# Altium project IO BOARD CERES-V3.PrjPcb
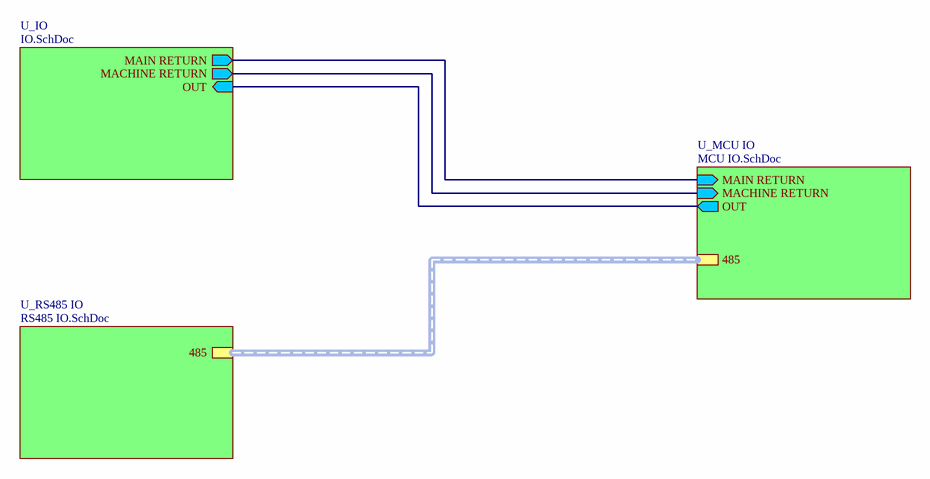
[diagram p0: TOPSHEET.SchDoc]
4 sheets, 56 parts. Net scope: hierarchical (ports join the sheet entries above them; power ports are global).
Board file: IO BOARD CERES V2.PcbDoc
Sheets:
  TOPSHEET.SchDoc
    U_IO = IO.SchDoc
    U_MCU IO = MCU IO.SchDoc
    U_RS485 IO = RS485 IO.SchDoc

## Sheet TOPSHEET.SchDoc: TOPSHEET
size A4; Date: 31 08 2013; Author: Rachid AKKOUCHE; CompanyName: MDI; DrawnBy: Rachid AKKOUCHE; Engineer: Rachid AKKOUCHE; Organization: RASoftware; Address1: 52 J03 rue de la crèche; Address2: 77100 MEAUX; Address3: FRANCE; DocumentNumber: BRA2013090103C1; Revision: C; SheetNumber: 1; SheetTotal: 4; Telephone: +33651604047; Email: rachid.akkouche@wanadoo.fr; Dessinepar: -; Verifiepar: -; Time: 13:22

### Sub-sheets
U_IO = IO.SchDoc: MAIN RETURN (out), OUT (in), MACHINE RETURN (out)
U_MCU IO = MCU IO.SchDoc: MAIN RETURN (in), 485 (harness EIA-485), OUT (out), MACHINE RETURN (in)
U_RS485 IO = RS485 IO.SchDoc: 485 (harness EIA-485)

### Nets
NetC2_1: sheet U_IO/MAIN RETURN, sheet U_MCU IO/MAIN RETURN
NetC3_1: sheet U_IO/MACHINE RETURN, sheet U_MCU IO/MACHINE RETURN
NetQ1_1: sheet U_IO/OUT, sheet U_MCU IO/OUT

### Buses and harness runs
harness sheet U_MCU IO/485 = sheet U_RS485 IO/485

### Notes on the sheet
- Ce document est la propriété de
- Project:
- Il ne peut être divulgué sans l'accord écrit de l'un de ses représentants dûment mandaté
- Title:
- Number:
- Date:
- Time:
- Size:
- A4
- Revision:
- Sheet
- of
- 52 J03 rue de la crèche
- Draw by:
- 77100 Meaux

## Sheet IO.SchDoc: IO
size A4; Date: 31 08 2013; Author: Rachid AKKOUCHE; CompanyName: MDI; DrawnBy: Rachid AKKOUCHE; Engineer: Rachid AKKOUCHE; Organization: RASoftware; Address1: 52 J03, rue de la crèche; Address2: 77100 MEAUX; Address3: FRANCE; DocumentNumber: BRA2013090103C3; Revision: C; SheetNumber: 3; SheetTotal: 4; Telephone: +33651604047; Email: rachid.akkouche@wanadoo.fr; Dessinepar: -; Verifiepar: -; Property: RASoftware; Time: 13:22
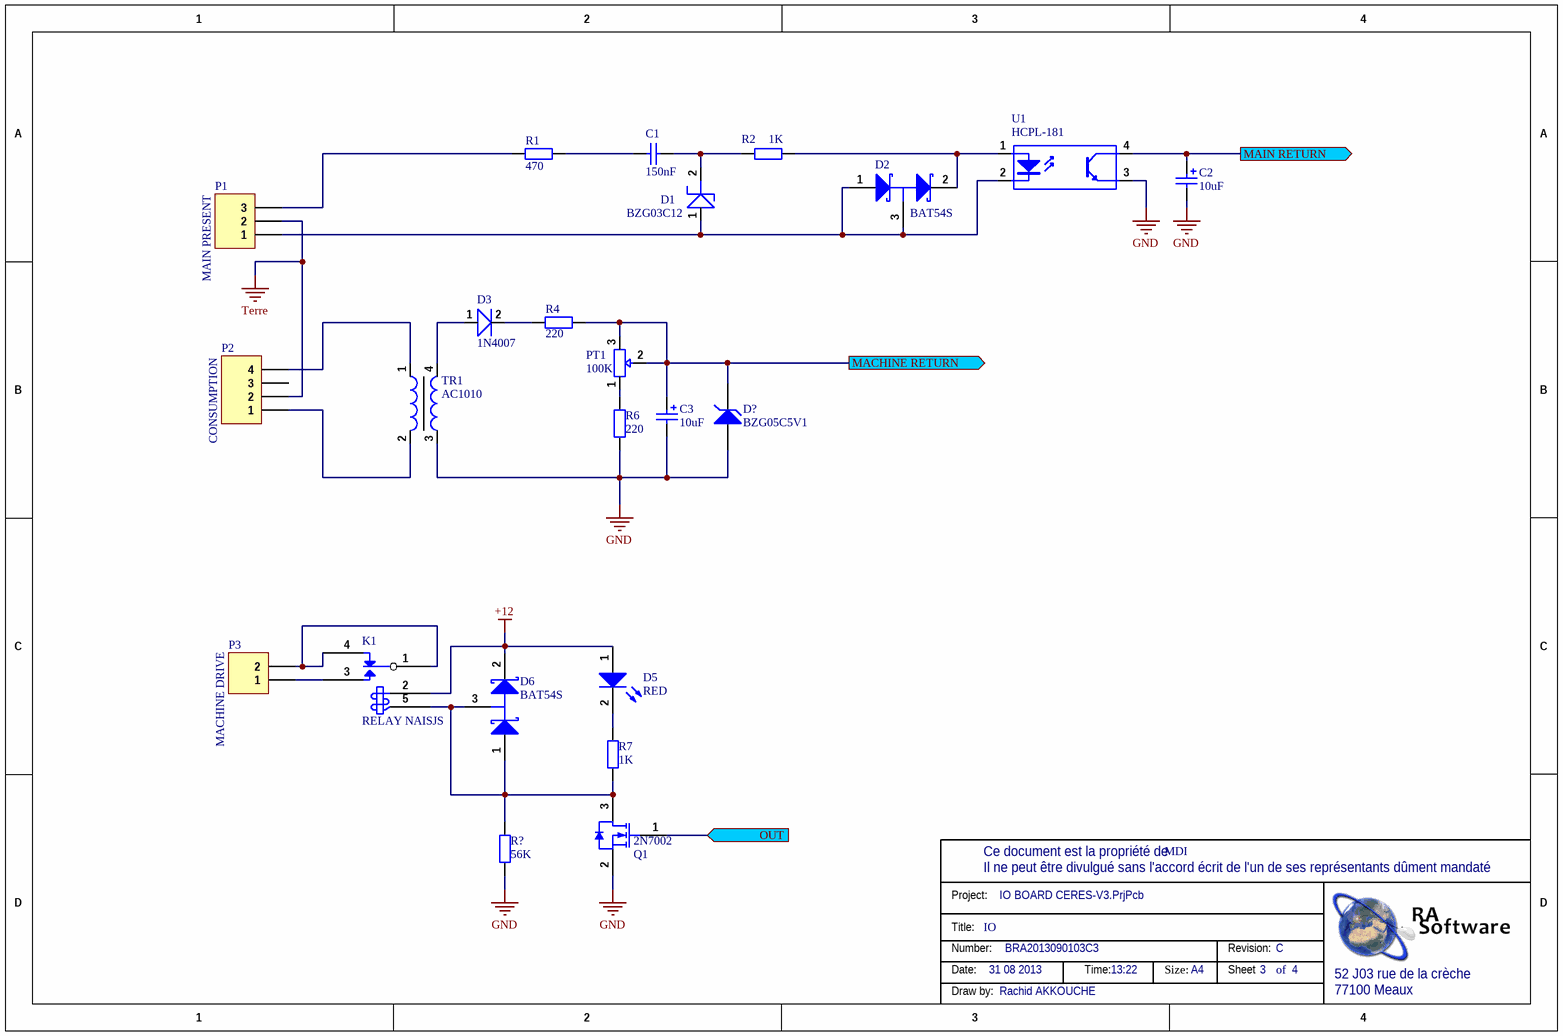
[diagram p1: IO.SchDoc]

### Parts
C1  150nF  [C1210]
C2  10uF  [Kemet_63]
C3  10uF  [Kemet_63]
D1  BZG03C12  [DO214AA]
D2  BAT54S  [SOT23]
D3  1N4007  [DO214AA]
D5  Couleur: RED  [0603-LEDR]  (hidden comment: HSMH-C190)
D6  BAT54S  [SOT23]
D?  BZG05C5V1  [DO214]
K1  RELAY NAISJS  [RELAIG5L]
P1  MAIN PRESENT  [CO3P508]
P2  CONSUMPTION  [CO4P508]
P3  MACHINE DRIVE  [CO2P508]
PT1  100K  [3361P]
Q1  2N7002  [SOT23]
R1  470  [R0805]
R2  1K  [R0805]
R4  220  [R0805]
R6  220  [R0805]
R7  1K  [R0805]
R?  56K  [R0805]
TR1  AC1010  [TR-AC10XX]
U1  HCPL-181  [OPTO-4PIN]

### Ports
MACHINE RETURN (out), MAIN RETURN (out), OUT (in)

### Nets
+12: D5.1(A) D6.2(K) K1.2(COIL1)
GND: C2.2 C3.2 D?.1(A) Q1.2(S) R6.1 R?.1 TR1.3 U1.3(E)
Terre: P1.2 P2.2
NetC1_1: C1.1 R1.1
NetC1_2: C1.2 D1.2 R2.1
NetC2_1: C2.1 U1.4(C) ; port MAIN RETURN
NetC3_1: C3.1 D?.2(K) PT1.2 PT1.3 R4.1 ; port MACHINE RETURN
NetD1_1: D1.1 D2.1(A) D2.3(C) P1.1 U1.2(K)
NetD2_2: D2.2(K) R2.2 U1.1(A)
NetD3_1: D3.1 TR1.4
NetD3_2: D3.2 R4.2
NetD5_2: D5.2(K) R7.2
NetD6_1: D6.1(A) D6.3(C) K1.5(COIL2) Q1.3(D) R7.1 R?.2
NetK1_1: K1.1(COMMON) K1.4(NC) P3.2
NetK1_3: K1.3(NO) P3.1
NetP1_3: P1.3 R1.2
NetP2_1: P2.1 TR1.2
NetP2_4: P2.4 TR1.1
NetPT1_1: PT1.1 R6.2
NetQ1_1: Q1.1(G) ; port OUT

Not connected (* = marked no-connect by the designer): P2 3

### Notes on the sheet
- Ce document est la propriété de
- Project:
- Il ne peut être divulgué sans l'accord écrit de l'un de ses représentants dûment mandaté
- Title:
- Number:
- Date:
- Time:
- Size:
- A4
- Revision:
- Sheet
- of
- 52 J03 rue de la crèche
- Draw by:
- 77100 Meaux

### Library data of the parts
C1 = Cap: Capacitor; Manufacturer: KEMET; Manufacturer Part Number: C1210V154KCRACTU; Gamme de produit: KEMET - ArcShield V Series; Capacité: 0.15; Tolérance de capacité: ± 10%; Diélectrique: X7; Tension: 500; Boîtier de condensateur Céramique: 1210 [3225 Metric]; Température d'utilisation min: -55; Température de fonctionnement max..: 125; Type de packaging: Bande découpée; SVHC: No SVHC (16-Dec-2013); Bornes de condensateur: CMS; Température de fonctionnement: -55°C à +125; Type de boîtier de condensateur: 1210 [3225 Metric]<!--FANDB--><div class="features-and-benefits-container"></div>; Supplier 1: Farnell; Supplier Part Number 1: 2085200; RoHS: YES; Pricing 1: 10=0,34, 50=0,28, 100=0,154, 500=0,125, 2500=0,097 (EUR); MSL: MSL 1 - Illimité; Tolérance de capacité ±: ± 10%; ComponentLink1URL: http://www.farnell.com/datasheets/1698777.pdf; ComponentLink1Description: http://www.farnell.com/datasheets/1698777.pdf
C2 C3 = Cap Pol 100uF: Polarized Capacitor; Manufacturer: EPCOS; Manufacturer Part Number: B41142A4107M; Product Range: EPCOS - B41142 Series; Capacité: 100; Tolérance de capacité: ± 20%; Tension: 16; Type de boîtier de condensateur: Radial Can - SMD; Diamètre: 6.3; Résistance, ESR: 0.16; Hauteur: 7.7; Courant d'ondulation c.a.: 300; Type de packaging: Cut Tape; Durée de vie @ température: 2000 heures @ 105; Température d'utilisation min: -55; Température de fonctionnement max..: 105; SVHC: No SVHC (19-Dec-2012); Impédance: 0.26; Température de fonctionnement: -55°C à +105; Température, ESR: 20; Type de boîtier: CMS; Supplier 1: Farnell; RoHS: YES; Pricing 1: 10=0,123, 50=0,095, 100=0,078, 250=0,07, 1000=0,062 (EUR); Courant d'ondulation c.a. à  100Hz: 300; Fréquence, impédance: 100; Longueur/hauteur: 7.7; Température, courant ondulatoire: 105; Température, impédance: 20; ComponentLink1URL: http://www.epcos.com/inf/20/30/db/alu_x/B41142.pdf; ComponentLink1Description: http://www.epcos.com/inf/20/30/db/alu_x/B41142.pdf; Supplier Part Number 1: 1735328
D1 = DZ: Manufacturer: VISHAY; Manufacturer Part Number: BZG03C12TR3; Supplier 1: Farnell; Supplier Part Number 1: 9398090; RoHS: YES; Pricing 1: 5=0,62, 100=0,37, 1500=0,26, 3000=0,138, 7000=0,135, 30000=0,132, 30000=0,129 (EUR); ComponentLink1URL: http://www.farnell.com/datasheets/69906.pdf; ComponentLink1Description: http://www.farnell.com/datasheets/69906.pdf
D2 D6 = BAT54S: Schottky Barrier Double Diode; Manufacturer: MULTICOMP; Courant, If moy.: 200; Tension, Vrrm: 30; Tension, Vf max..: 400; Temps trr max.: 5; Courant, Ifs max.: 600; Type de boîtier diode: SOT-23; Nombre de broches: 3; SVHC: No SVHC (19-Dec-2012); Configuration diode: Dual Series; Température, Tj max..: 150; Type de terminaison: SMD; Température d'utilisation min: -55; Courant, If, Vf: 10; Courant, Ir, max..: 2; Marquage, CMS: L44; Température de fonctionnement: -55°C à +150; Supplier 1: Farnell; Supplier Part Number 1: 1621835; Manufacturer Part Number: BAT54S; RoHS: YES; Stock 1: 52055; Pricing 1: 10=0,102, 250=0,074, 1000=0,06, 3000=0,053 (EUR); Diode Type: Schottky; Type de boîtier: SOT-23; courant Ifsm: 600; ComponentLink1URL: http://www.farnell.com/datasheets/1317753.pdf; ComponentLink1Description: http://www.farnell.com/datasheets/1317753.pdf; Température de fonctionnement max..: 150
D3 = D: Manufacturer: DC COMPONENTS; Manufacturer Part Number: S1M; Unit: pcs; SuppliedAmount: 3000; MinAmount: 10; Multiples: 1; Diode type: rectifying; Off state voltage max.: 1kV; Forward voltage at If: 1.1V; Load current: 1A; Reverse recovery time: 1.8µs; Capacitance: 12pF; Supplier 1: TME; Supplier Part Number 1: S1M; Category: SMD Universal Diodes; Stock 1: 88611; Pricing 1: 10=0,069, 50=0,048, 250=0,044, 1000=0,039, 5000=0,036 (USD); Weight: 0,213; Price Type: NET; Mounting: SMD; Case: DO214AA; ComponentLink1URL: http://www.tme.eu/en/details/s1m/smd-universal-diodes/dc-components/; ComponentLink1Description: http://www.tme.eu/en/details/s1m/smd-universal-diodes/dc-components/
D5 = HSMH-C190: Surface Mount Chip LED, Red; Manufacturer: AVAGO TECHNOLOGIES; Manufacturer Part Number: HSMH-C190.; Taille de lampe: 0.8mm x 1; Couleur de LED: Rouge; Intensité lumineuse: 17; Angle, vision: 170°; Courant, direct, If: 20; Tension, direct à  If: 1.8; Montage LED: CMS; Forme de lentille: Rectangulaire; Longueur d'onde typ.: 626; SVHC: No SVHC (19-Dec-2012); Dissipation de puissance: 65; Intensité lumineuse min. à  If: 2.8; Intensité lumineuse typique: 10; Largeur (externe): 0.8; Longueur d'onde dominante: 639; Longueur d'onde, crête: 630; Longueur/hauteur: 1.6; Matière: AlGaAs; Nombre de broches: 2; Orientation de montage opto: Dessus; Orientation sortie de lumière: Top Emitting; Température de fonctionnement: -30°C à +85; Température de fonctionnement max..: 85; Température, stockage min.: -40; Température d'utilisation min: -30; Tension, Vf max..: 2.6; Tension, Vf min.: 2.1; Type de LED: Standard; Supplier 1: Farnell; Supplier Part Number 1: 8554641; RoHS: YES; Pricing 1: 5=0,06, 25=0,059, 100=0,057, 250=0,052, 500=0,047 (EUR); MSL: MSL 2A - 4 semaines; Couleur, LED: Rouge; Profondeur: 0.8; Température, stockage max..: 85; Tension, Vf typ.: 1.8; ComponentLink1URL: http://www.farnell.com/datasheets/313031.pdf; ComponentLink1Description: http://www.farnell.com/datasheets/313031.pdf; ComponentLink2URL: http://www.farnell.com/datasheets/55927.pdf; ComponentLink2Description: http://www.farnell.com/datasheets/55927.pdf
D? = BZG05C5V1: Silicon Zener Diode (3W); Manufacturer: VISHAY; Unit: pcs; SuppliedAmount: 100; MinAmount: 5; Multiples: 1; Zener voltage: 5.1V; Zener current: 45mA; Zener resistance: 10Ω; Supplier 1: TME; Supplier Part Number 1: BZG05C5V1; Manufacturer Part Number: BZG05C5V1; Category: SMD Zener Diodes; Stock 1: 1665; Weight: 0,098; Price Type: NET; Diode type: Zener; Power: 3W; Mounting: SMD; Case: DO214AC; ComponentLink1URL: http://www.tme.eu/en/details/bzg05c5v1/smd-zener-diodes/vishay/; ComponentLink1Description: http://www.tme.eu/en/details/bzg05c5v1/smd-zener-diodes/vishay/
K1 = RELAY NAISJS: Manufacturer: OMRON ELECTRONIC COMPONENTS; Manufacturer Part Number: G5LA1A412DC; Type de relais: Puissance; Tension, bobine c.c. nom.: 12; Courant de contact max..: 10; Tension AC nominale du contact: 250; Tension DC nominale du contact: 24; Résistance, bobine: 400; Configuration des contacts: SPST-NO; Type de bobine: CC; Courant de bobine: 30; Puissance de fonctionnement nominale: 360; Montage relais: Traversant; Largeur (externe): 15.8; Profondeur: 19.8; SVHC: No SVHC (20-Jun-2013); Supplier 1: Farnell; Supplier Part Number 1: 2213790; RoHS: YES; Pricing 1: 1=0,84, 10=0,74, 50=0,66, 100=0,59, 250=0,54 (EUR); Hauteur, dimension externe: 15.8; ComponentLink1URL: http://www.farnell.com/datasheets/1648381.pdf; ComponentLink1Description: http://www.farnell.com/datasheets/1648381.pdf
P1 = Header 3: Header, 3-Pin; Manufacturer: TE CONNECTIVITY / BUCHANAN; Manufacturer Part Number: 796636-3; Supplier 1: Farnell; Supplier Part Number 1: 2059780; RoHS: YES; Pricing 1: 10=0,68, 100=0,51, 500=0,43, 1000=0,36, 2000=0,35, 5000=0,33 (EUR); ComponentLink1URL: http://www.farnell.com/cad/1652960.pdf; ComponentLink1Description: http://www.farnell.com/cad/1652960.pdf; ComponentLink2URL: http://www.farnell.com/datasheets/1650926.pdf; ComponentLink2Description: http://www.farnell.com/datasheets/1650926.pdf
P2 = Header 4: Header, 4-Pin; Manufacturer: TE CONNECTIVITY / BUCHANAN; Manufacturer Part Number: 796636-4; Supplier 1: Farnell; Supplier Part Number 1: 2059781; RoHS: YES; Stock 1: 207; ComponentLink1URL: http://www.farnell.com/cad/1652960.pdf; ComponentLink1Description: http://www.farnell.com/cad/1652960.pdf; ComponentLink2URL: http://www.farnell.com/datasheets/1650926.pdf; ComponentLink2Description: http://www.farnell.com/datasheets/1650926.pdf
P3 = Header 2: Header, 2-Pin; Manufacturer: TE CONNECTIVITY / BUCHANAN; Manufacturer Part Number: 796636-2; Terminaison du contact: Traversant vertical; Genre: Embase; Nombre de contacts: 2; Nombre de rangées: 1; Pas: 5.08; Plaquage du contact: Etain; Matériau du contact: Bronze phosphoreux<!--FANDB--><div class="features-and-benefits-container"></div>; Supplier 1: Farnell; Supplier Part Number 1: 2059815; RoHS: YES; Pricing 1: 10=0,5, 100=0,39, 500=0,34, 1000=0,27, 2000=0,211, 5000=0,207, 5000=0,203, 30000=0,199 (EUR); Gamme de produit: -; ComponentLink1URL: http://www.farnell.com/cad/1652960.pdf; ComponentLink1Description: http://www.farnell.com/cad/1652960.pdf; ComponentLink2URL: http://www.farnell.com/datasheets/1509424.pdf; ComponentLink2Description: http://www.farnell.com/datasheets/1509424.pdf
PT1 = RV: Manufacturer: BOURNS; Manufacturer Part Number: 3361P-1-104GLF; Résistance, piste: 100; Nombre de tours: 1; Tolérance de résistance: ± 10%; Coefficient de température: ± 100; Puissance: 500; Montage du potentiomètre: CMS; SVHC: No SVHC (16-Dec-2013); Force diélectrique, Vca: 900; Largeur (externe): 6.71; Longueur/hauteur: 5.21; Profondeur: 7.04; Série: 3361; Température de fonctionnement: -55°C à +125; Température de fonctionnement max..: 125; Température d'utilisation min: -55; Tension: 300; Type d'ajustement: Fente tournevis; Type de packaging: Bande découpée; Type de résistance: Cermet<!--FANDB--><div class="features-and-benefits-container"></div>; Supplier 1: Farnell; Supplier Part Number 1: 1696064; RoHS: YES; Pricing 1: 5=1,35, 50=1,11, 100=0,99, 250=0,93, 750=0,87 (EUR); ComponentLink1URL: http://www.farnell.com/datasheets/1563530.igs; ComponentLink1Description: http://www.farnell.com/datasheets/1563530.igs; ComponentLink2URL: http://www.farnell.com/datasheets/1815105.pdf; ComponentLink2Description: http://www.farnell.com/datasheets/1815105.pdf; ComponentLink3URL: http://www.farnell.com/cad/1563578.stp; ComponentLink3Description: http://www.farnell.com/cad/1563578.stp
Q1 = 2N7002: N-channel Enhancement Mode Field-effect Transistor; Manufacturer: FAIRCHILD SEMICONDUCTOR; Supplier 1: Farnell; Supplier Part Number 1: 9845313; Manufacturer Part Number: 2N7002; RoHS: YES; Pricing 1: 5=0,138, 25=0,13, 100=0,059, 1000=0,049, 3000=0,026, 6000=0,0234 (EUR); ComponentLink1URL: http://www.farnell.com/datasheets/660093.pdf; ComponentLink1Description: http://www.farnell.com/datasheets/660093.pdf; ComponentLink2URL: http://www.farnell.com/datasheets/410597.pdf; ComponentLink2Description: http://www.farnell.com/datasheets/410597.pdf
R1 = Resistor 0805 470: Resistor; Manufacturer: MULTICOMP; Manufacturer Part Number: MC0.1W08051%470RFR; Supplier 1: Farnell; Supplier Part Number 1: 2129087; RoHS: YES; Pricing 1: 5000=0,001 (EUR); ComponentLink1URL: http://www.farnell.com/datasheets/1636796.pdf; ComponentLink1Description: http://www.farnell.com/datasheets/1636796.pdf
R2 = Res2: Resistor; Manufacturer: MULTICOMP; Manufacturer Part Number: MC0.1W08051%1KFR; Product Range: MULTICOMP - MC Series; Résistance: 1; Puissance: 100; Tolérance de résistance: ± 1%; Type de boîtier de résistance: 0805; Type de résistance: Couche épaisse; Coefficient de température: ± 100; Tension: 150; Type de packaging: Full Reel; Resistor Mounting: CMS; Supplier 1: Farnell; Supplier Part Number 1: 2129113; RoHS: YES; Stock 1: 599995; Pricing 1: 5000=0,001 (EUR); MSL: MSL 1 - Illimité; ComponentLink1URL: http://www.farnell.com/datasheets/1636796.pdf; ComponentLink1Description: http://www.farnell.com/datasheets/1636796.pdf
R4 R6 = Resistor 0805 220: Resistor; Manufacturer: MULTICOMP; Manufacturer Part Number: MC01W08051220R; Gamme de produit: MULTICOMP - MC Series; Puissance: 100; Tolérance de résistance: ± 1%; Type de boîtier de résistance: 0805; Type de résistance: Couche épaisse; Coefficient de température: ± 100; Tension: 150; Type de packaging: Bande et Bobine; SVHC: No SVHC (20-Jun-2013); Montage de résistance: CMS; Quantité par bobine: 5000; Supplier 1: Farnell; RoHS: YES; Stock 1: 199995; Pricing 1: 5000=0,001, 25000=0,0009, 50000=0,0008 (EUR); Résistance: 220; MSL: -; ComponentLink1URL: http://www.farnell.com/datasheets/1729047.pdf; ComponentLink1Description: http://www.farnell.com/datasheets/1729047.pdf; Supplier Part Number 1: 2129060
R7 = Resistor 0805 1K: Resistor; Manufacturer: MULTICOMP; Manufacturer Part Number: MC0.1W08051%1KFR; Product Range: MULTICOMP - MC Series; Résistance: 1; Puissance: 100; Tolérance de résistance: ± 1%; Type de boîtier de résistance: 0805; Type de résistance: Couche épaisse; Coefficient de température: ± 100; Tension: 150; Type de packaging: Full Reel; Resistor Mounting: CMS; Supplier 1: Farnell; RoHS: YES; Pricing 1: 5000=0,001 (EUR); MSL: MSL 1 - Illimité; ComponentLink1URL: http://www.farnell.com/datasheets/1716700.pdf; ComponentLink1Description: http://www.farnell.com/datasheets/1716700.pdf; Supplier Part Number 1: 2129113
R? = Resistor 0805 56K: Resistor; Manufacturer: MULTICOMP; Manufacturer Part Number: MC0.1W08051%56KFR; Product Range: MULTICOMP - MC Series; Résistance: 56; Puissance: 100; Tolérance de résistance: ± 1%; Type de boîtier de résistance: 0805; Type de résistance: Couche épaisse; Coefficient de température: ± 100; Tension: 150; Type de packaging: Full Reel; Resistor Mounting: CMS; Resistor Terminals: (Non Disponible); Supplier 1: Farnell; RoHS: YES; Pricing 1: 5000=0,001 (EUR); MSL: (Non Applicable); ComponentLink1URL: http://www.farnell.com/datasheets/1716700.pdf; ComponentLink1Description: http://www.farnell.com/datasheets/1716700.pdf; Supplier Part Number 1: 2129258
TR1 = AC1010: Manufacturer: ACME ELECTRIC; Manufacturer Part Number: AC-1010; Input Current: 10; Turns Ratio: 1; Frequency Min: 50; Frequency Max: 60; Secondary Burden Resistance: 41.8; Transformer Mounting: Through Hole; External Depth: 11.12; Supplier 1: Farnell; Supplier Part Number 1: 1707836; RoHS: YES; Pricing 1: 1=12,43, 10=10,33, 25=8,31, 50=7,37, 100=6,71 (EUR); DC Resistance Max: 41.8; ComponentLink1URL: http://www.amveco.com/pdf/AC1010.pdf; ComponentLink1Description: http://www.amveco.com/pdf/AC1010.pdf
U1 = Optoisolator1: 4-Pin Phototransistor Optocoupler; Manufacturer: AVAGO TECHNOLOGIES; Manufacturer Part Number: HCPL-181-00AE; Supplier 1: Farnell; Supplier Part Number 1: 1244526RL; RoHS: YES; Pricing 1: 150=0,27, 250=0,217, 500=0,191, 2000=0,143, 2000=0,14, 20000=0,137 (EUR); ComponentLink1URL: http://www.farnell.com/datasheets/317140.pdf; ComponentLink1Description: http://www.farnell.com/datasheets/317140.pdf

## Sheet MCU IO.SchDoc: MCU
size A4; Date: 30 08 2013; Author: Rachid AKKOUCHE; CompanyName: MDI; DrawnBy: Rachid AKKOUCHE; Engineer: Rachid AKKOUCHE; Organization: RASoftware; Address1: 52 J03, rue de la crèche; Address3: 77100 MEAUX; Address4: FRANCE; DocumentNumber: BRA2013090103C2; Revision: C; SheetNumber: 2; SheetTotal: 4; Telephone: +33651604047; Email: rachid.akkouche@wanadoo.fr; Dessinepar: -; Verifiepar: -; Property: RASoftware; Time: 13:00; ProjectName: IO BOARD CERES-V3; Application_BuildNumber: 01
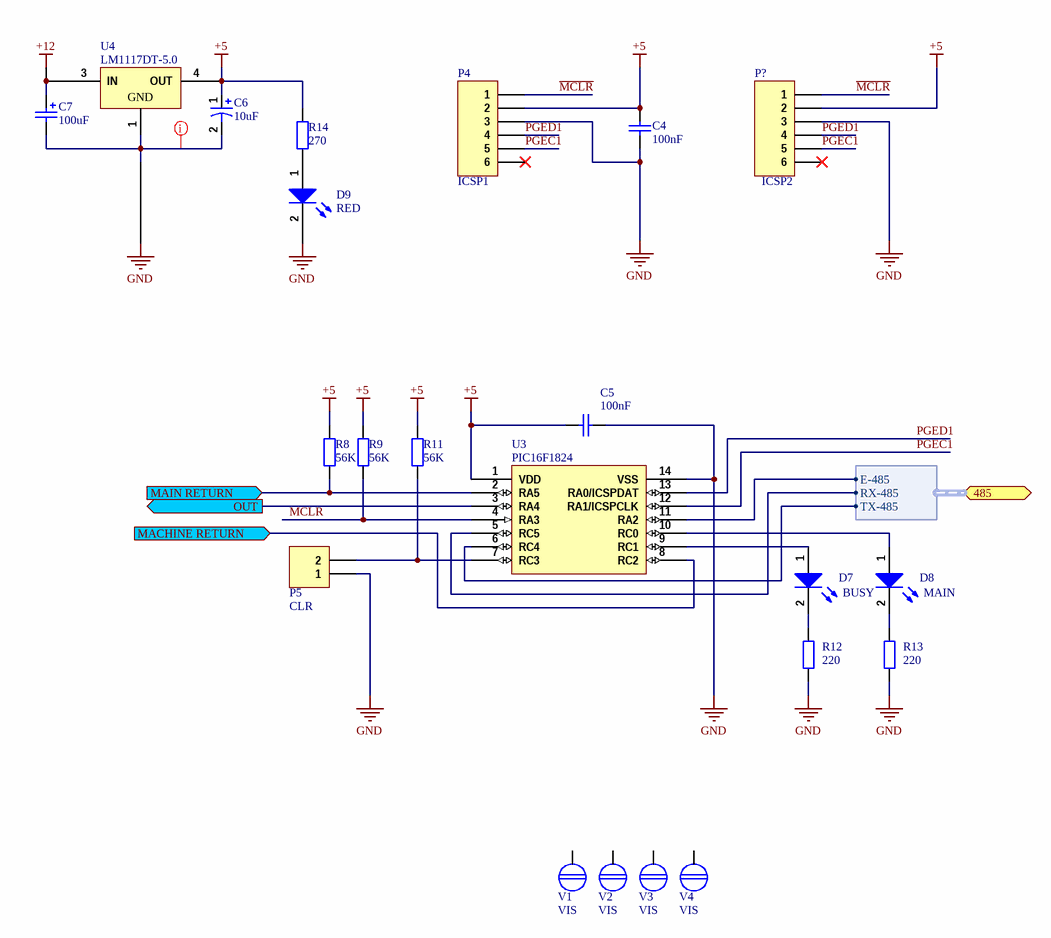
[diagram p2: MCU IO.SchDoc]

### Parts
C4  100nF  [C0805]
C5  100nF  [C0805]
C6  10uF  [KEMET_4]
C7  100uF  [Kemet_63]
D7  Indicator: BUSY  [0603-LEDR]  (hidden comment: HSMH-C190)
D8  Indicator: MAIN  [0603-LEDR]  (hidden comment: HSMH-C190)
D9  Couleur: RED  [0603-LEDR]  (hidden comment: HSMH-C190)
P4  ICSP1  [TC2030]
P5  CLR  [M20_1X2]
P?  ICSP2  [6SIP100]
R8  56K  [R0805]
R9  56K  [R0805]
R11  56K  [R0805]
R12  220  [R0805]
R13  220  [R0805]
R14  270  [R0805]
U3  PIC16F1824  [so-14]
U4  LM1117DT-5.0  [SOT223]
V1  VIS  [VIS42]
V2  VIS  [VIS42]
V3  VIS  [VIS42]
V4  VIS  [VIS42]

### Ports
485 (harness EIA-485), MACHINE RETURN (in), MAIN RETURN (in), OUT (out)

### Harnesses
EIA-485: TX-485, RX-485, E-485

### Nets
+5: C4.2 C5.2 C6.1 P4.2 P?.2 R8.2 R9.2 R11.2 R14.2 U3.1(VDD) U4.4(OUT)
+12: C7.1 U4.3(IN)
GND: C4.1 C5.1 C6.2 C7.2 D9.2(K) P4.3 P5.1 P?.3 R12.1 R13.1 U3.14(VSS) U4.1(GND)
~{MCLR}: P4.1 P?.1 R9.1 U3.4(RA3)
PGEC1: P4.5 P?.5 U3.12(RA1/ICSPCLK)
PGED1: P4.4 P?.4 U3.13(RA0/ICSPDAT)
NetC2_1: R8.1 U3.2(RA5) ; port MAIN RETURN
NetC3_1: U3.8(RC2) ; port MACHINE RETURN
NetD7_1: D7.1(A) U3.9(RC1)
NetD7_2: D7.2(K) R12.2
NetD8_1: D8.1(A) U3.10(RC0)
NetD8_2: D8.2(K) R13.2
NetD9_1: D9.1(A) R14.1
NetP5_2: P5.2 R11.1 U3.7(RC3)
NetQ1_1: U3.3(RA4) ; port OUT
NetR18_2: U3.11(RA2) ; port 485.E-485
NetU3_5: U3.5(RC5) ; port 485.RX-485
NetU3_6: U3.6(RC4) ; port 485.TX-485

Not connected (* = marked no-connect by the designer): P4 6*; P? 6*; V1 1; V2 1; V3 1; V4 1

### Layout directives
rule Width Constraint [Pref Width = 0.55mm    Min Width = 0.254mm    Max Width = 2mm]: GND

### Notes on the sheet
- Ce document est la propriété de
- Project:
- Il ne peut être divulgué sans l'accord écrit de l'un de ses représentants dûment mandaté
- Title:
- Number:
- Date:
- Time:
- Size:
- A4
- Revision:
- Sheet
- of
- 52 J03 rue de la crèche
- Draw by:
- 77100 Meaux

### Library data of the parts
C4 C5 = Cap 0805 100nF: Capacitor; Manufacturer: MULTICOMP; Manufacturer Part Number: MCCA000296; Supplier 1: Farnell; Supplier Part Number 1: 1759167; Pricing 1: 100=0,01, 500=0,008, 1000=0,006, 4000=0,005 (EUR); ComponentLink1URL: http://www.farnell.com/datasheets/1520827.pdf; ComponentLink1Description: http://www.farnell.com/datasheets/1520827.pdf
C6 = Cap Pol1: Polarized Capacitor; Manufacturer: KEMET; Manufacturer Part Number: EXV106M025A9BAA; Supplier 1: Farnell; Supplier Part Number 1: 2069174; RoHS: YES; Pricing 1: 10=0,111, 100=0,085, 500=0,074, 1000=0,07, 5000=0,066 (EUR); ComponentLink1URL: http://www.farnell.com/datasheets/1500293.pdf; ComponentLink1Description: http://www.farnell.com/datasheets/1500293.pdf
C7 = Cap Pol 100uF: as C2 on sheet IO; Supplier 1: Farnell; RoHS: YES; Pricing 1: 10=0,123, 50=0,095, 100=0,078, 250=0,07, 1000=0,062 (EUR); Courant d'ondulation c.a. à  100Hz: 300; Fréquence, impédance: 100; Longueur/hauteur: 7.7; Température, courant ondulatoire: 105; Température, impédance: 20; ComponentLink1URL: http://www.epcos.com/inf/20/30/db/alu_x/B41142.pdf; ComponentLink1Description: http://www.epcos.com/inf/20/30/db/alu_x/B41142.pdf; Supplier Part Number 1: 1735328
D7-D9 = HSMH-C190: as D5 on sheet IO; Supplier 1: Farnell; Supplier Part Number 1: 8554641; RoHS: YES; Pricing 1: 5=0,06, 25=0,059, 100=0,057, 250=0,052, 500=0,047 (EUR); MSL: MSL 2A - 4 semaines; Couleur, LED: Rouge; Profondeur: 0.8; Température, stockage max..: 85; Tension, Vf typ.: 1.8; ComponentLink1URL: http://www.farnell.com/datasheets/313031.pdf; ComponentLink1Description: http://www.farnell.com/datasheets/313031.pdf; ComponentLink2URL: http://www.farnell.com/datasheets/55927.pdf; ComponentLink2Description: http://www.farnell.com/datasheets/55927.pdf
  D7 D8: Couleur: RED
  D9: Stock 1: 13902
P4 = Header 6: Header, 6-Pin; Manufacturer: HARWIN; Manufacturer Part Number: M20-8770642; Type de connecteur: Contact fil-à-carte; Série: M20; Terminaison du contact: Montage en surface vertical; Genre: Embase; Nombre de contacts: 6; Nombre de rangées: 1; Pas: 2.54; Plaquage du contact: Or; Matériau du contact: Laiton; SVHC: No SVHC (19-Dec-2012); Supplier 1: Farnell; Supplier Part Number 1: 1517384; RoHS: YES; Stock 1: 3471; Pricing 1: 10=0,69, 20=0,66, 50=0,62, 100=0,6, 250=0,56, 500=0,49 (EUR); Pas, rang: 2.54; ComponentLink1URL: http://www.farnell.com/datasheets/1089524.pdf; ComponentLink1Description: http://www.farnell.com/datasheets/1089524.pdf; ComponentLink2URL: http://www.farnell.com/datasheets/5481.pdf; ComponentLink2Description: http://www.farnell.com/datasheets/5481.pdf
P5 = Header 2: Header, 2-Pin; Manufacturer: HARWIN; Manufacturer Part Number: M20-8770242; LatestRevisionDate: 17-Jul-2002; LatestRevisionNote: Re-released for DXP Platform.; Publisher: Altium Limited; Supplier 1: Farnell; Supplier Part Number 1: 1895211; RoHS: YES; Pricing 1: 10=0,137, 20=0,136, 50=0,135, 100=0,133, 250=0,128, 500=0,12 (EUR); ComponentLink1URL: http://www.farnell.com/cad/1330190.pdf; ComponentLink1Description: http://www.farnell.com/cad/1330190.pdf
P? = Header 6: Header, 6-Pin; Manufacturer: TE CONNECTIVITY / AMP; Manufacturer Part Number: 4-103321-8.; Série: AMPMODU; Pas: 2.54; Nombre de rangées: 1; Nombre de contacts: 40; Genre: Embase; Terminaison du contact: A souder; Plaquage du contact: Etain; Matériau du contact: Bronze phosphoreux; Courant: 3; Matériau isolant: Thermoplastique; Organismes d'agrément: CSA, UL; Résistance d'isolement: 500; Température de fonctionnement max..: 105; Température d'utilisation min: -65; Type de boitier: Plastique noir UL94V-0; Supplier 1: Farnell; Supplier Part Number 1: 1098454; RoHS: YES; Stock 1: 2602; Pricing 1: 1=2,12, 50=1,79, 100=1,34, 500=1,14, 1000=1,05 (EUR); Méthode de terminaison: A souder; ComponentLink1URL: http://www.tycoelectronics.com/commerce/DocumentDelivery/DDEController?Action=srchrtrv&DocNm=4-103321-8&DocType=Customer+View+Model&DocLang=English; ComponentLink1Description: http://www.tycoelectronics.com/commerce/DocumentDelivery/DDEController?Action=srchrtrv&DocNm=4-103321-8&DocType=Customer+View+Model&DocLang=English; ComponentLink2URL: http://www.farnell.com/datasheets/38278.pdf; ComponentLink2Description: http://www.farnell.com/datasheets/38278.pdf
R8 R9 R11 = Resistor 0805 56K: as R? on sheet IO; Supplier 1: Farnell; RoHS: YES; Pricing 1: 5000=0,001 (EUR); MSL: (Non Applicable); ComponentLink1URL: http://www.farnell.com/datasheets/1716700.pdf; ComponentLink1Description: http://www.farnell.com/datasheets/1716700.pdf; Supplier Part Number 1: 2129258
R12 R13 = Resistor 0805 220: as R4 on sheet IO; Supplier 1: Farnell; RoHS: YES; Stock 1: 199995; Pricing 1: 5000=0,001, 25000=0,0009, 50000=0,0008 (EUR); Résistance: 220; MSL: -; ComponentLink1URL: http://www.farnell.com/datasheets/1729047.pdf; ComponentLink1Description: http://www.farnell.com/datasheets/1729047.pdf; Supplier Part Number 1: 2129060
R14 = Resistor 0805 1K: as R7 on sheet IO; Supplier 1: Farnell; RoHS: YES; Pricing 1: 5000=0,001 (EUR); MSL: MSL 1 - Illimité; ComponentLink1URL: http://www.farnell.com/datasheets/1716700.pdf; ComponentLink1Description: http://www.farnell.com/datasheets/1716700.pdf; Supplier Part Number 1: 2129113
U3 = PIC16(L)F1824: 14 Pin Flash Microcontrollers with XLP Technology; Manufacturer: MICROCHIP; Manufacturer Part Number: PIC16F1824-I/SL; Supplier 1: Farnell; RoHS: YES; Stock 1: 516; ComponentLink1URL: http://www.farnell.com/datasheets/1669488.pdf; ComponentLink1Description: http://www.farnell.com/datasheets/1669488.pdf; ComponentLink2URL: http://www.farnell.com/cad/1689044.zip; ComponentLink2Description: http://www.farnell.com/cad/1689044.zip; Supplier Part Number 1: 1814945
U4 = LM1117DT-5.0: 800mA Low-Dropout Linear Regulator, 3-pin TO-252; Manufacturer: TEXAS INSTRUMENTS; Manufacturer Part Number: LM1117MP-5.0; Supplier 1: Farnell; Supplier Part Number 1: 9778209; RoHS: YES; Pricing 1: 1=0,9, 10=0,86, 100=0,73 (EUR); ComponentLink1URL: http://www.farnell.com/datasheets/1685500.pdf; ComponentLink1Description: http://www.farnell.com/datasheets/1685500.pdf; ComponentLink2URL: http://www.farnell.com/cad/1562101.zip; ComponentLink2Description: http://www.farnell.com/cad/1562101.zip

## Sheet RS485 IO.SchDoc: RS-485
size A4; Date: 31 08 2013; Author: Rachid AKKOUCHE; CompanyName: MDI; DrawnBy: Rachid AKKOUCHE; Engineer: Rachid AKKOUCHE; Organization: RASoftware; Address1: 52 J03, rue de la crèche; Address2: 77100 MEAUX; Address3: FRANCE; DocumentNumber: BRA2013090103C4; Revision: C; SheetNumber: 4; SheetTotal: 4; Telephone: +33651604047; Email: rachid.akkouche@wanadoo.fr; Dessinepar: -; Verifiepar: -; Property: RASoftware; Time: 13:22
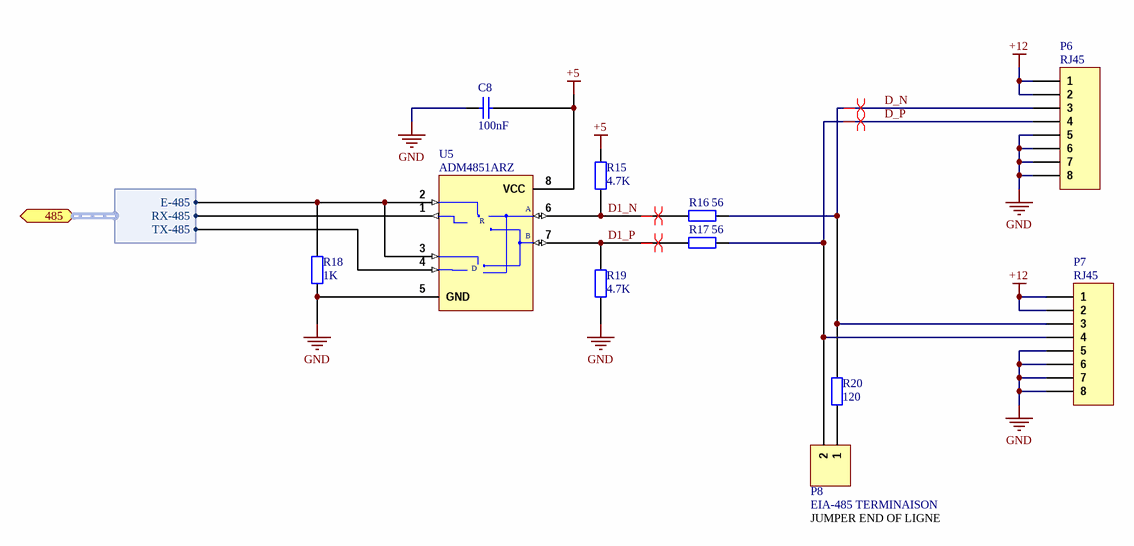
[diagram p3: RS485 IO.SchDoc]

### Parts
C8  100nF  [C0805]
P6  RJ45  [Amphenol-RJ45_8]
P7  RJ45  [Amphenol-RJ45_8]
P8  EIA-485 TERMINAISON  [M20_1X2]
R15  4.7K  [R0805]
R16  56  [R0805]
R17  56  [R0805]
R18  1K  [R0805]
R19  4.7K  [R0805]
R20  120  [R0805]
U5  ADM4851ARZ  [SOIC8]

### Ports
485 (harness EIA-485)

### Harnesses
EIA-485: TX-485, RX-485, E-485

### Nets
+5: C8.1 R15.2 U5.8(VCC)
+12: P6.1 P6.2 P7.1 P7.2
GND: C8.2 P6.5 P6.6 P6.7 P6.8 P7.5 P7.6 P7.7 P7.8 R18.1 R19.1 U5.5(GND)
D1_N: R15.1 R16.1 U5.6(A)
D1_P: R17.1 R19.2 U5.7(B)
D_N: P6.3 P7.3 R16.2 R20.2
D_P: P6.4 P7.4 P8.2 R17.2
NetP8_1: P8.1 R20.1
NetR18_2: R18.2 U5.2(~{RE}) U5.3(DE) ; port 485.E-485
NetU3_5: U5.1(RO) ; port 485.RX-485
NetU3_6: U5.4(DI) ; port 485.TX-485

### Layout directives
differential pair: D1_N, D1_P, D_N, D_P

### Notes on the sheet
- JUMPER END OF LIGNE
- Ce document est la propriété de
- Project:
- Il ne peut être divulgué sans l'accord écrit de l'un de ses représentants dûment mandaté
- Title:
- Number:
- Date:
- Time:
- Size:
- A4
- Revision:
- Sheet
- of
- 52 J03 rue de la crèche
- Draw by:
- 77100 Meaux
- (in symbol MAX485ESA) R; D

### Library data of the parts
C8 = Cap 0805 100nF: as C4 on sheet MCU IO; Supplier 1: Farnell; Supplier Part Number 1: 1759167; Pricing 1: 100=0,01, 500=0,008, 1000=0,006, 4000=0,005 (EUR); ComponentLink1URL: http://www.farnell.com/datasheets/1520827.pdf; ComponentLink1Description: http://www.farnell.com/datasheets/1520827.pdf
P6 P7 = Header 8: Header, 8-Pin; Manufacturer: MOLEX; Manufacturer Part Number: 85502-5008; Supplier 1: Farnell; Supplier Part Number 1: 1331561; RoHS: YES; Pricing 1: 1=1,34, 10=0,873, 50=0,797, 100=0,662, 200=0,597, 500=0,541, 500=0,496, 5000=0,493 (EUR); ComponentLink1URL: http://www.farnell.com/cad/1712028.pdf; ComponentLink1Description: http://www.farnell.com/cad/1712028.pdf; ComponentLink2URL: http://www.farnell.com/datasheets/1827260.pdf; ComponentLink2Description: http://www.farnell.com/datasheets/1827260.pdf
P8 = Header 2: Header, 2-Pin; Manufacturer: HARWIN; Manufacturer Part Number: M20-8770242; Product Range: HARWIN - M20-87 Series; Terminaison du contact: PCB; Genre: Connecteur mâle; Nombre de contacts: 2; Nombre de rangées: 1; Pas: 2.54; Plaquage du contact: Or; Matériau du contact: Laiton; SVHC: No SVHC (20-Jun-2013); LatestRevisionDate: 17-Jul-2002; LatestRevisionNote: Re-released for DXP Platform.; Publisher: Altium Limited; Supplier 1: Farnell; Supplier Part Number 1: 1895211; RoHS: YES; Pricing 1: 10=0,137, 20=0,136, 50=0,135, 100=0,133, 250=0,128, 500=0,12 (EUR); ComponentLink1URL: http://www.farnell.com/cad/1330190.pdf; ComponentLink1Description: http://www.farnell.com/cad/1330190.pdf
R15 R19 = Resistor 0805 4.7K: Resistor; Manufacturer: MULTICOMP; Manufacturer Part Number: MC01W080514K7; Product Range: MULTICOMP - MC Series; Résistance: 4.7; Puissance: 100; Tolérance de résistance: ± 1%; Type de boîtier de résistance: 0805; Type de résistance: Couche épaisse; Coefficient de température: ± 100; Tension: 150; Type de packaging: Full Reel; SVHC: No SVHC (20-Jun-2013); Resistor Mounting: CMS; Supplier 1: Farnell; RoHS: YES; Pricing 1: 5000=0,001 (EUR); MSL: (Non Applicable); ComponentLink1URL: http://www.farnell.com/datasheets/1729047.pdf; ComponentLink1Description: http://www.farnell.com/datasheets/1729047.pdf; Supplier Part Number 1: 2129167
R16 R17 = Resistor 0805 56: Resistor; Manufacturer: MULTICOMP; Manufacturer Part Number: MC01W0805156R; Product Range: MULTICOMP - MC Series; Puissance: 100; Tolérance de résistance: ± 1%; Type de boîtier de résistance: 0805; Type de résistance: Couche épaisse; Coefficient de température: ± 200; Tension: 150; Type de packaging: Full Reel; SVHC: No SVHC (20-Jun-2013); Resistor Mounting: CMS; Supplier 1: Farnell; RoHS: YES; Pricing 1: 5000=0,001 (EUR); Résistance: 56; MSL: (Non Applicable); ComponentLink1URL: http://www.farnell.com/datasheets/1729047.pdf; ComponentLink1Description: http://www.farnell.com/datasheets/1729047.pdf; Supplier Part Number 1: 2129016
R18 = Resistor 0805 1K: as R7 on sheet IO; Supplier 1: Farnell; RoHS: YES; Pricing 1: 5000=0,001 (EUR); MSL: MSL 1 - Illimité; ComponentLink1URL: http://www.farnell.com/datasheets/1716700.pdf; ComponentLink1Description: http://www.farnell.com/datasheets/1716700.pdf; Supplier Part Number 1: 2129113
R20 = Resistor 0805 120: Resistor; Manufacturer: MULTICOMP; Manufacturer Part Number: MC01W080516K49; Product Range: MULTICOMP - MC Series; Résistance: 6.49; Puissance: 100; Tolérance de résistance: ± 1%; Type de boîtier de résistance: 0805; Type de résistance: Couche épaisse; Coefficient de température: ± 100; Tension: 150; Type de packaging: Full Reel; SVHC: No SVHC (20-Jun-2013); Resistor Mounting: CMS; Supplier 1: Farnell; RoHS: YES; Pricing 1: 5000=0,001 (EUR); MSL: (Non Applicable); ComponentLink1URL: http://www.farnell.com/datasheets/1729047.pdf; ComponentLink1Description: http://www.farnell.com/datasheets/1729047.pdf; Supplier Part Number 1: 2129181
U5 = MAX485ESA: Low-Power, Slew-Rate-Limited RS-485/RS-422 Transceiver; Manufacturer: ANALOG DEVICES; Type de driver: Émetteur-récepteur de ligne différentiel; Type d'interface CI: RS422, RS485; Nombre de drivers: 1; Tension, alimentation min.: 4.75; Tension, alimentation max..: 5.25; Type de boîtier CI Driver: NSOIC; Nombre de broches: 8; Température d'utilisation min: -40; Température de fonctionnement max..: 85; SVHC: No SVHC (20-Jun-2013); Supplier 1: Farnell; Supplier Part Number 1: 2313594; Manufacturer Part Number: ADM4851ARZ; RoHS: YES; Pricing 1: 1=1,39, 10=1,13, 100=1,01, 250=0,9, 500=0,79 (EUR); MSL: MSL 1 - Illimité; ComponentLink1URL: http://www.analog.com/static/imported-files/data_sheets/ADM4850_4851_4852_4853_4854_4855_4856_4857.pdf; ComponentLink1Description: http://www.analog.com/static/imported-files/data_sheets/ADM4850_4851_4852_4853_4854_4855_4856_4857.pdf; ComponentLink2URL: http://www.farnell.com/cad/1713403.zip; ComponentLink2Description: http://www.farnell.com/cad/1713403.zip

## Nets that join several sheets
+5: MCU IO (11 pins), RS485 IO (C8.1 R15.2 U5.8)
+12: IO (D5.1 D6.2 K1.2), MCU IO (C7.1 U4.3), RS485 IO (P6.1 P6.2 P7.1 P7.2)
GND: IO (8 pins), MCU IO (12 pins), RS485 IO (12 pins)
NetC2_1: IO (C2.1 U1.4), MCU IO (R8.1 U3.2)
NetC3_1: IO (5 pins), MCU IO (U3.8)
NetQ1_1: IO (Q1.1), MCU IO (U3.3)
NetR18_2: MCU IO (U3.11), RS485 IO (R18.2 U5.2 U5.3)
NetU3_5: MCU IO (U3.5), RS485 IO (U5.1)
NetU3_6: MCU IO (U3.6), RS485 IO (U5.4)